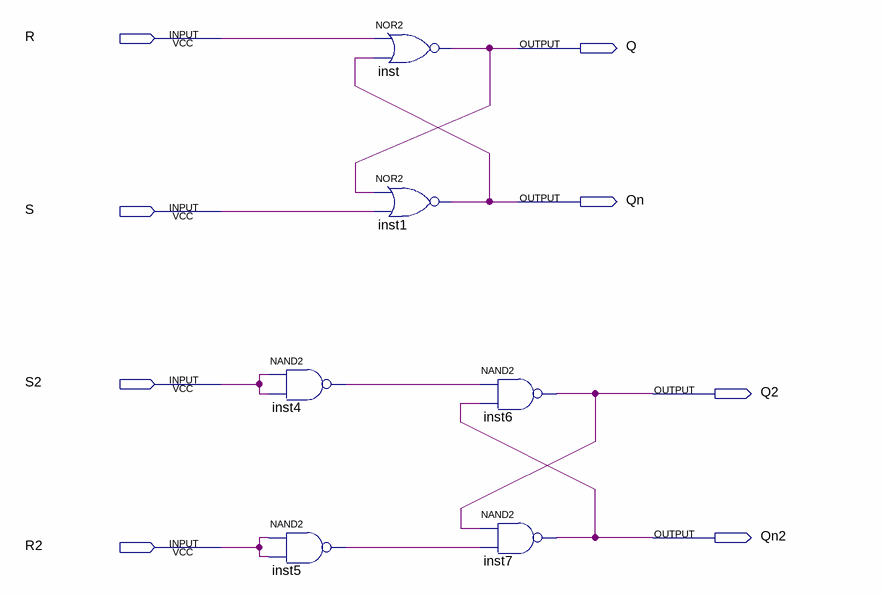
[diagram p0: schematic sheet]
// Quartus schematic lab9step1.bdf as structural Verilog: 6 symbols, 8 pins
module lab9step1 (
  input  R,
  input  S,
  input  S2,
  input  R2,
  output Q,
  output Qn,
  output Q2,
  output Qn2
);

  wire inst4_out, inst5_out;

  nand inst4 (inst4_out, S2, S2);
  nand inst5 (inst5_out, R2, R2);
  nor inst (Q, R, Qn);
  nor inst1 (Qn, Q, S);
  nand inst6 (Q2, inst4_out, Qn2);
  nand inst7 (Qn2, Q2, inst5_out);
endmodule
